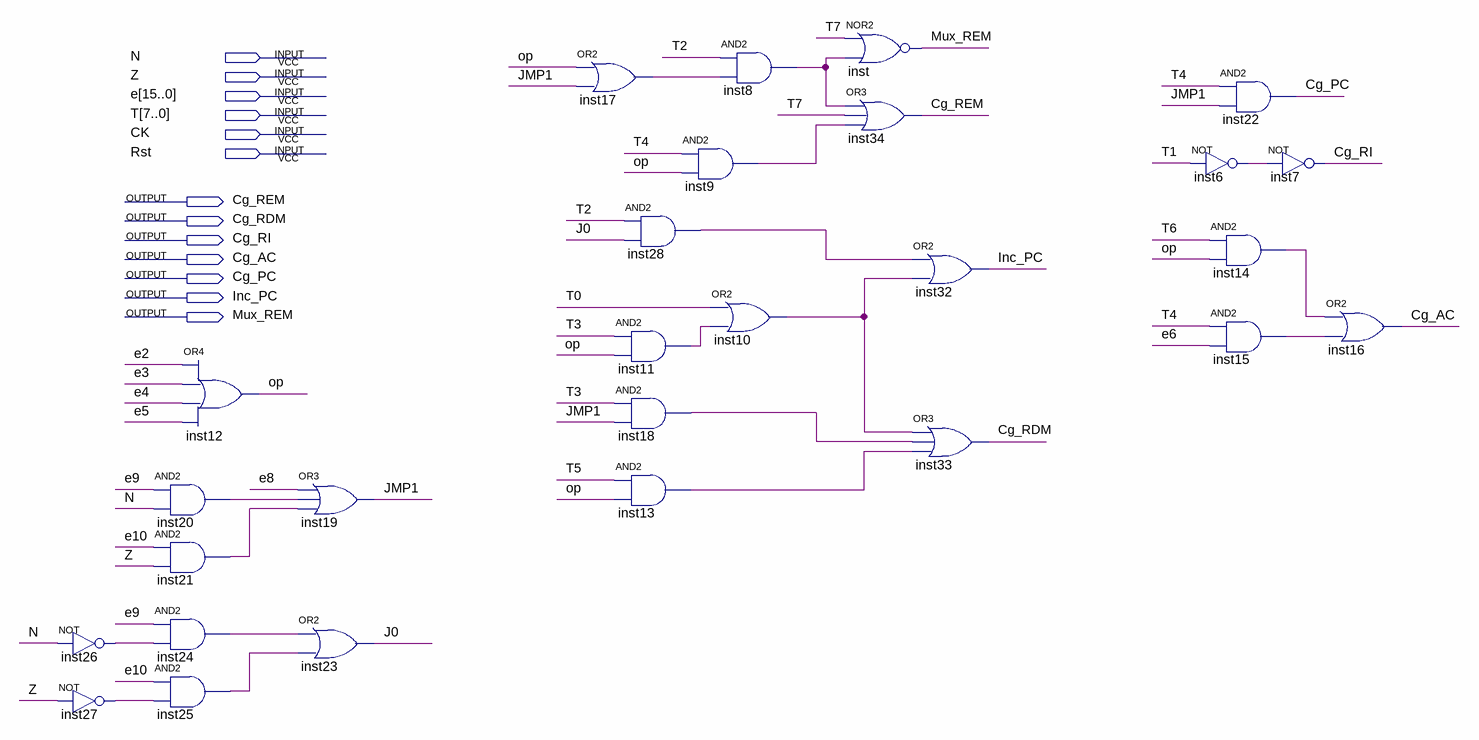
[diagram p0: schematic sheet]
// Quartus schematic CONTROLE.bdf as structural Verilog: 27 symbols, 13 pins
module CONTROLE (
  input  N,
  input  Z,
  input  [15:0] e,
  input  [7:0] T,
  input  CK,
  input  Rst,
  output Cg_REM,
  output Cg_RDM,
  output Cg_RI,
  output Cg_AC,
  output Cg_PC,
  output Inc_PC,
  output Mux_REM
);

  wire inst6_out, inst8_out, inst9_out, inst10_out, inst11_out, inst13_out, inst14_out, inst15_out,
       inst17_out, inst18_out, inst20_out, inst21_out, inst24_out, inst25_out, inst26_out, inst27_out,
       inst28_out, J0, JMP1, op;

  not inst26 (inst26_out, N);
  not inst27 (inst27_out, Z);
  and inst20 (inst20_out, e[9], N);
  and inst21 (inst21_out, e[10], Z);
  and inst24 (inst24_out, e[9], inst26_out);
  and inst25 (inst25_out, e[10], inst27_out);
  or inst12 (op, e[2], e[3], e[4], e[5]);
  or inst19 (JMP1, e[8], inst20_out, inst21_out);
  or inst23 (J0, inst24_out, inst25_out);
  or inst17 (inst17_out, op, JMP1);
  and inst11 (inst11_out, T[3], op);
  and inst18 (inst18_out, T[3], JMP1);
  and inst13 (inst13_out, T[5], op);
  and inst9 (inst9_out, T[4], op);
  and inst28 (inst28_out, T[2], J0);
  and inst8 (inst8_out, T[2], inst17_out);
  or inst10 (inst10_out, T[0], inst11_out);
  nor inst (Mux_REM, T[7], inst8_out);
  or inst34 (Cg_REM, inst8_out, T[7], inst9_out);
  or inst32 (Inc_PC, inst28_out, inst10_out);
  or inst33 (Cg_RDM, inst10_out, inst18_out, inst13_out);
  and inst22 (Cg_PC, T[4], JMP1);
  not inst6 (inst6_out, T[1]);
  and inst14 (inst14_out, T[6], op);
  and inst15 (inst15_out, T[4], e[6]);
  not inst7 (Cg_RI, inst6_out);
  or inst16 (Cg_AC, inst14_out, inst15_out);
endmodule
